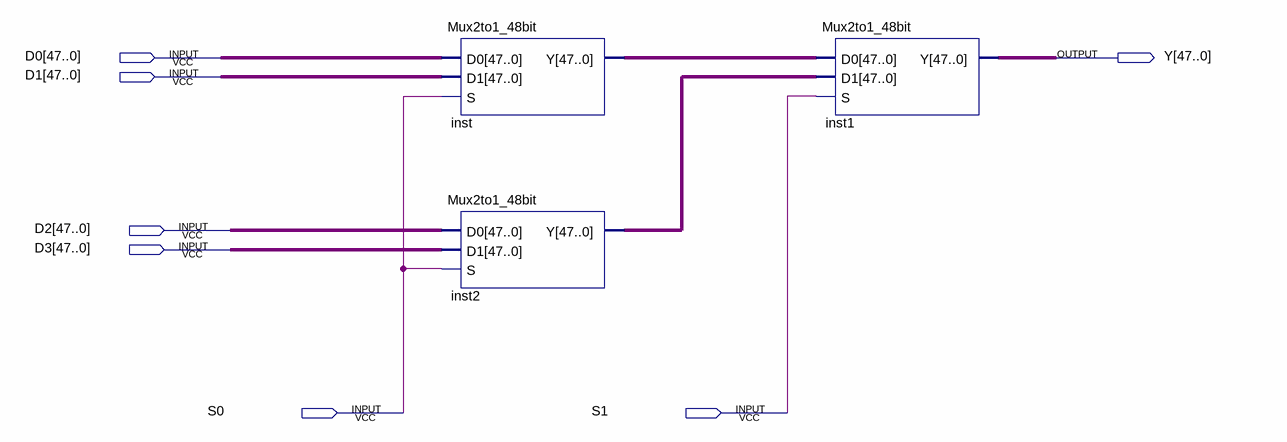
[diagram p0: schematic sheet]
// Quartus schematic Mux4to1_48bit.bdf as structural Verilog: 3 symbols, 7 pins
module Mux4to1_48bit (
  input  [47:0] D0,
  input  [47:0] D1,
  input  [47:0] D2,
  input  [47:0] D3,
  input  S0,
  input  S1,
  output [47:0] Y
);

  wire [47:0] inst2_y, inst_y;

  Mux2to1_48bit inst (.D0(D0), .D1(D1), .S(S0), .Y(inst_y));
  Mux2to1_48bit inst2 (.D0(D2), .D1(D3), .S(S0), .Y(inst2_y));
  Mux2to1_48bit inst1 (.D0(inst_y), .D1(inst2_y), .S(S1), .Y(Y));
endmodule
